# Altium project PSRR.PrjPcb
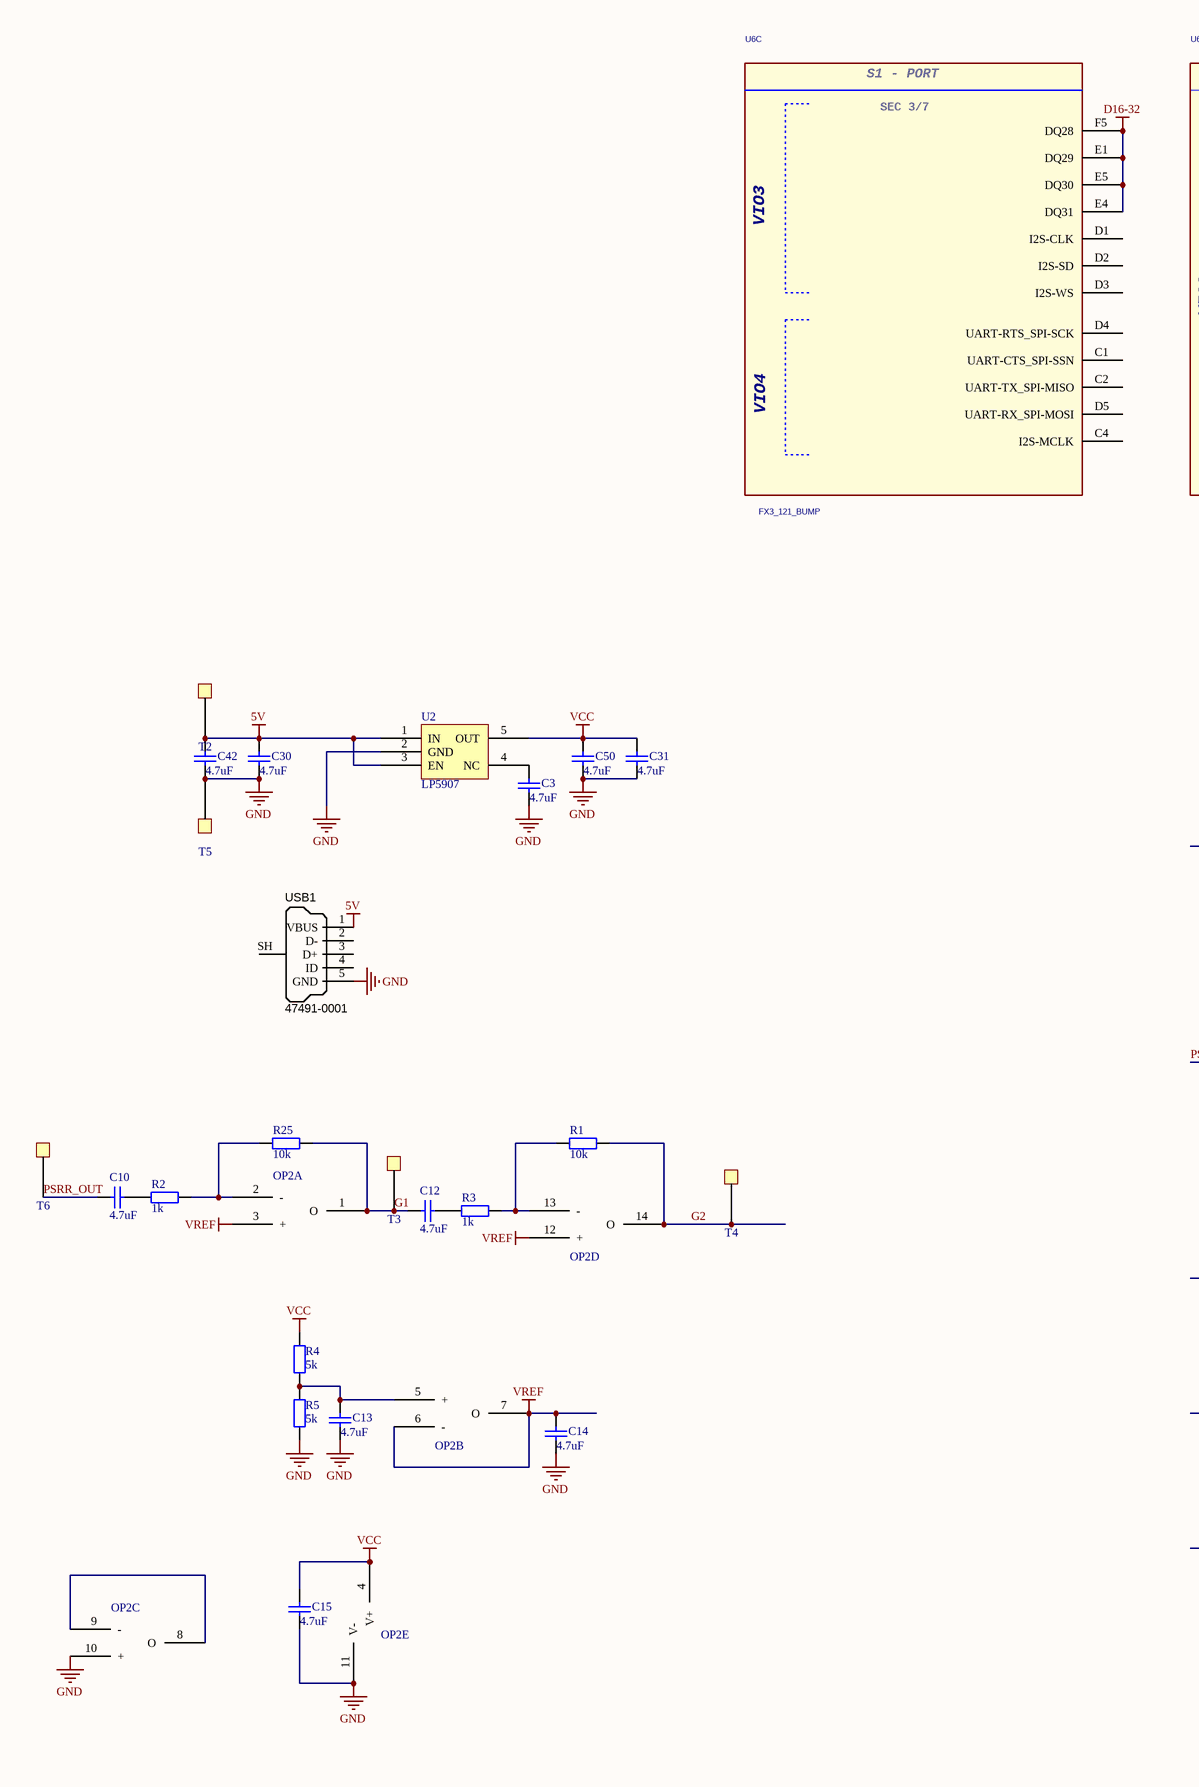
[diagram p0: PSRR.SchDoc, left]
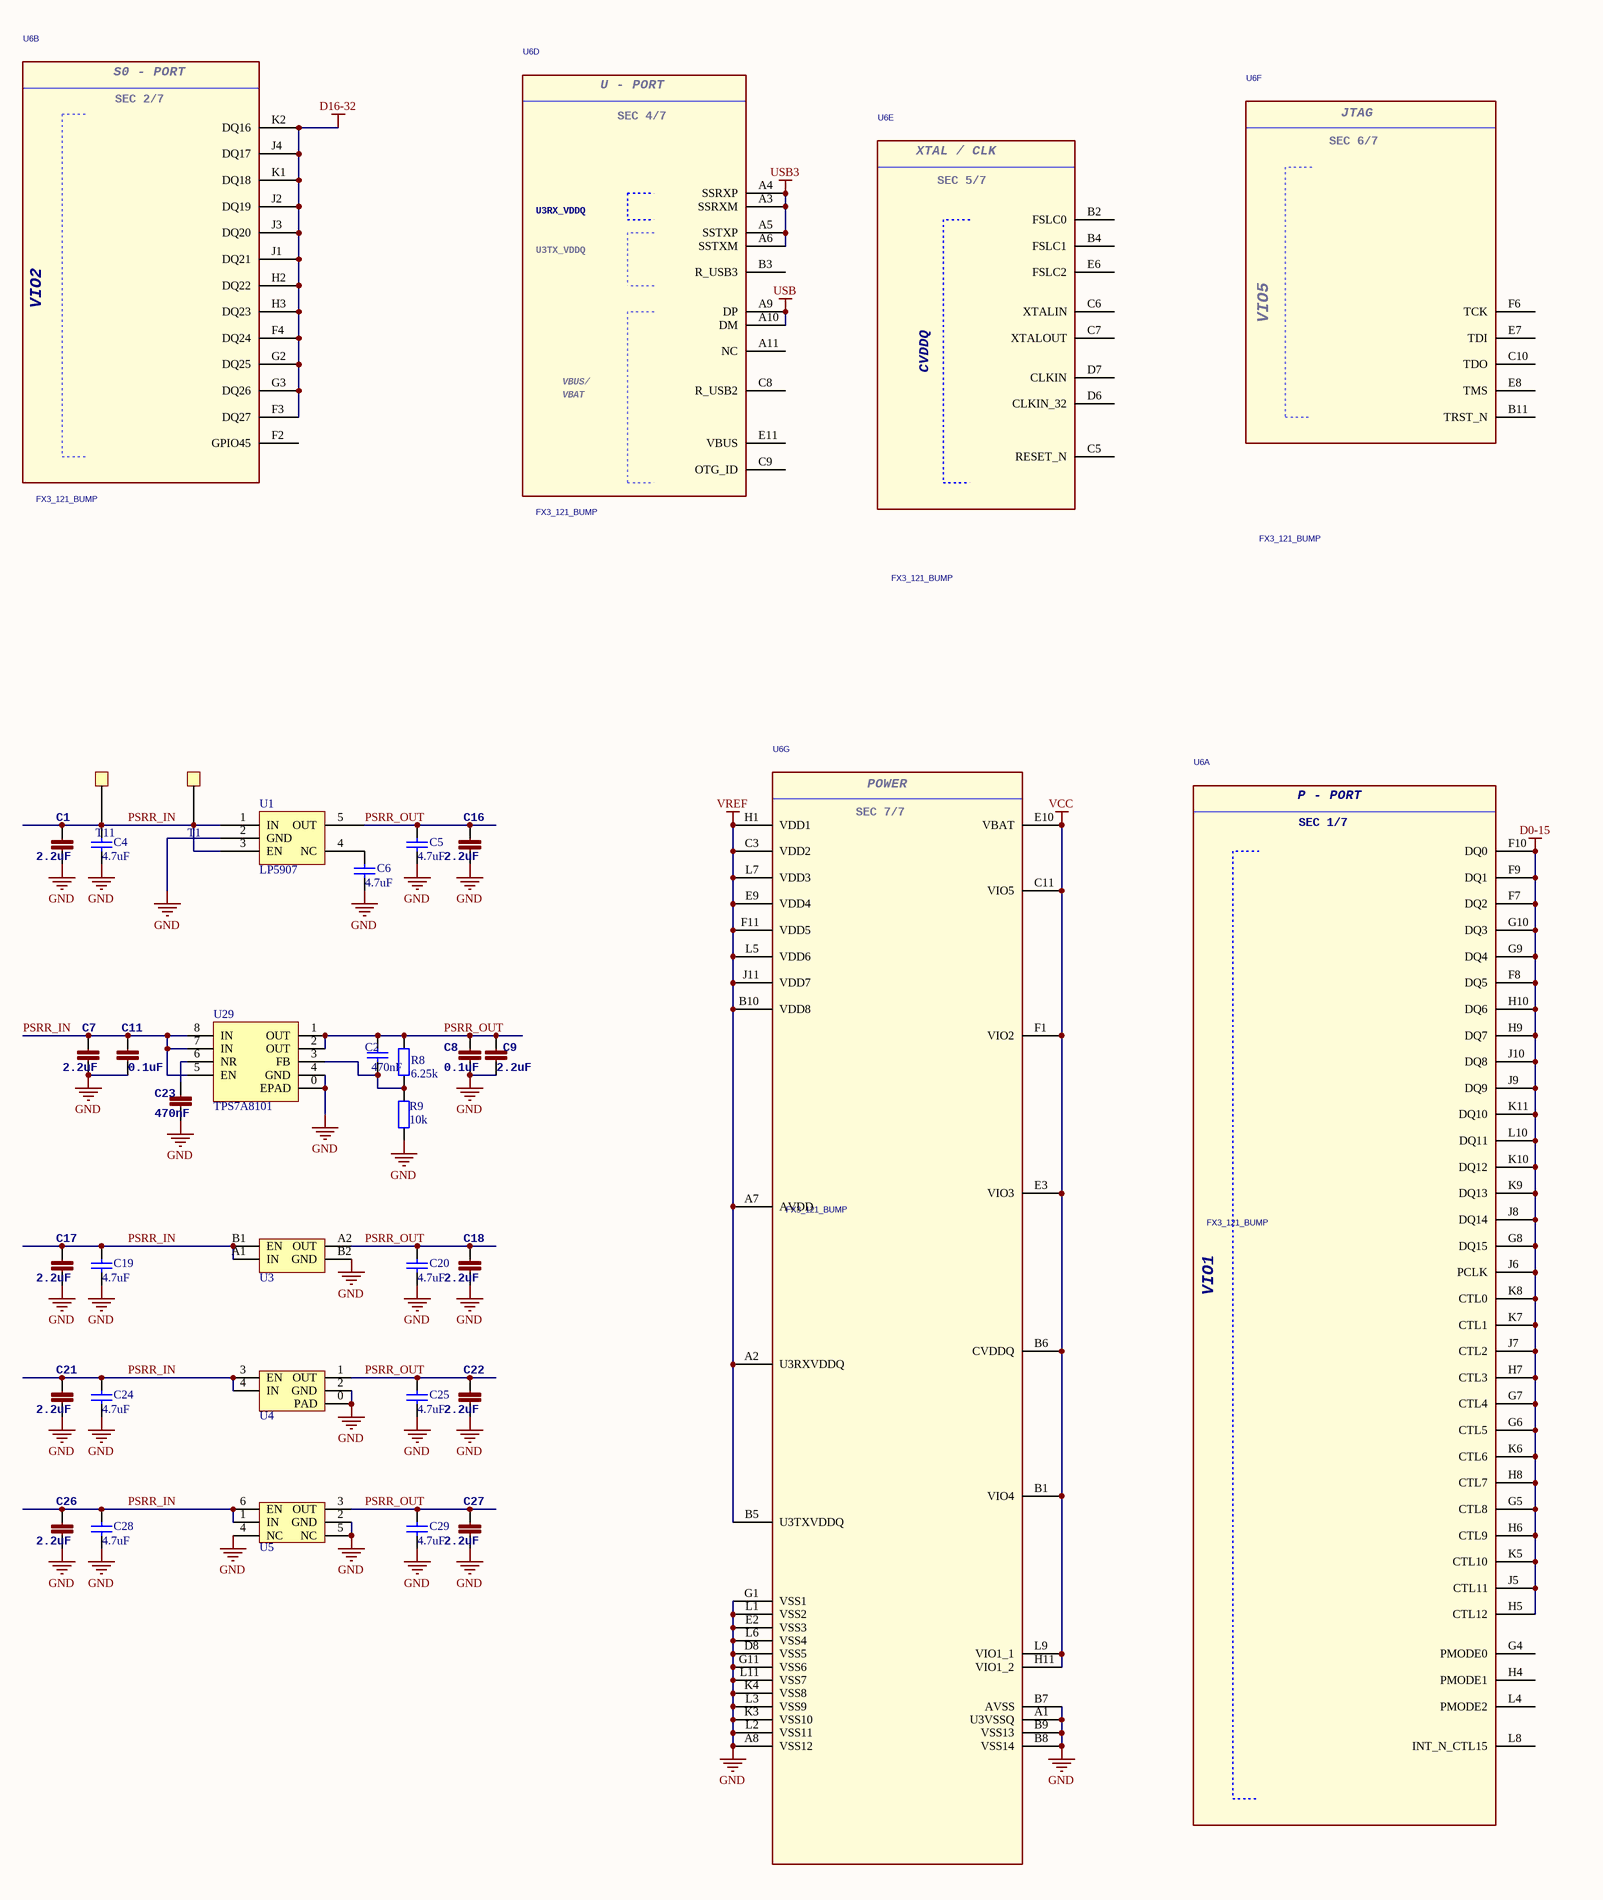
[diagram p1: PSRR.SchDoc, right]
1 sheet, 57 parts. Net scope: global (net labels, ports and power ports of the same name join across sheets).
Board file: PSRR.PcbDoc

## Sheet PSRR.SchDoc
size A2

### Parts
C1  2.2uF  [0603]
C2  470nF  [0402]
C3  4.7uF  [0603]
C4  4.7uF  [0603]
C5  4.7uF  [0603]
C6  4.7uF  [0603]
C7  2.2uF  [0603]
C8  0.1uF  [0603]
C9  2.2uF  [0603]
C10  4.7uF  [0603]
C11  0.1uF  [0402]
C12  4.7uF  [0603]
C13  4.7uF  [0603]
C14  4.7uF  [0603]
C15  4.7uF  [0603]
C16  2.2uF  [0603]
C17  2.2uF  [0603]
C18  2.2uF  [0603]
C19  4.7uF  [0603]
C20  4.7uF  [0603]
C21  2.2uF  [0603]
C22  2.2uF  [0603]
C23  470nF  [0402]
C24  4.7uF  [0603]
C25  4.7uF  [0603]
C26  2.2uF  [0402]
C27  2.2uF  [0402]
C28  4.7uF  [0402]
C29  4.7uF  [0402]
C30  4.7uF  [0603]
C31  4.7uF  [0603]
C42  4.7uF  [0603]
C50  4.7uF  [0603]
OP2  MCP6024  (value not drawn)  (parts A,B,C,D,E of 5)
R1  10k  [0402]
R2  1k  [0402]
R3  1k  [0402]
R4  5k  [0402]
R5  5k  [0402]
R8  6.25k  [0402]
R9  10k  [0402]
R25  10k  [0402]
T1  TestPad  [TestPad]  (value not drawn)
T2  TestPad  [TestPad]  (value not drawn)
T3  TestPad  [TestPad]  (value not drawn)
T4  TestPad  [TestPad]  (value not drawn)
T5  TestPad  [TestPad]  (value not drawn)
T6  TestPad  [TestPad]  (value not drawn)
T11  TestPad  [TestPad]  (value not drawn)
U1  LP5907  [SOT23-5]
U2  LP5907  [SOT23-5]
U3  LP5907-BGA  [DSBGA-4]  (value not drawn)
U4  LP5907-X2SON  [X2SON]  (value not drawn)
U5  TLV700xx-WSON  [WSON]  (value not drawn)
U6  FX3_121_BUMP  [FX3_121_BUMP]  (parts A,B,C,D,E,F,G of 8)
U29  TPS7A8101  [TPS7A8101]
USB1  Manufacturer Part Number 1: 47491-0001  [MICRO-YZX]  (hidden comment: USB Micro Type B)

### Nets
5V: C30.2 C42.2 T2.1 U2.1(IN) U2.3(EN) USB1.1(VBUS)
D0-15: U6.F7(DQ2) U6.F8(DQ5) U6.F9(DQ1) U6.F10(DQ0) U6.G5(CTL8) U6.G6(CTL5) U6.G7(CTL4) U6.G8(DQ15) U6.G9(DQ4) U6.G10(DQ3) U6.H5(CTL12) U6.H6(CTL9) U6.H7(CTL3) U6.H8(CTL7) U6.H9(DQ7) U6.H10(DQ6) U6.J5(CTL11) U6.J6(PCLK) U6.J7(CTL2) U6.J8(DQ14) U6.J9(DQ9) U6.J10(DQ8) U6.K5(CTL10) U6.K6(CTL6) U6.K7(CTL1) U6.K8(CTL0) U6.K9(DQ13) U6.K10(DQ12) U6.K11(DQ10) U6.L10(DQ11)
D16-32: U6.E1(DQ29) U6.E4(DQ31) U6.E5(DQ30) U6.F3(DQ27) U6.F4(DQ24) U6.F5(DQ28) U6.G2(DQ25) U6.G3(DQ26) U6.H2(DQ22) U6.H3(DQ23) U6.J1(DQ21) U6.J2(DQ19) U6.J3(DQ20) U6.J4(DQ17) U6.K1(DQ18) U6.K2(DQ16)
GND: C1.1 C3.1 C4.1 C5.1 C6.1 C7.1 C8.1 C9.1 C11.1 C13.1 C14.1 C15.1 C16.1 C17.1 C18.1 C19.1 C20.1 C21.1 C22.1 C23.1 C24.1 C25.1 C26.1 C27.1 C28.1 C29.1 C30.1 C31.1 C42.1 C50.1 OP2.10(+) OP2.11(V-) R5.2 R9.2 T5.1 U1.2(GND) U2.2(GND) U3.B2(GND) U4.0(PAD) U4.2(GND) U5.2(GND) U5.4(NC) U5.5(NC) U6.A1(U3VSSQ) U6.A8(VSS12) U6.B7(AVSS) U6.B8(VSS14) U6.B9(VSS13) U6.D8(VSS5) U6.E2(VSS3) U6.G1(VSS1) U6.G11(VSS6) U6.K3(VSS10) U6.K4(VSS8) U6.L1(VSS2) U6.L2(VSS11) U6.L3(VSS9) U6.L6(VSS4) U6.L11(VSS7) U29.0(EPAD) U29.4(GND) USB1.5(GND)
USB: U6.A9(DP) U6.A10(DM)
USB3: U6.A3(SSRXM) U6.A4(SSRXP) U6.A5(SSTXP) U6.A6(SSTXM)
VCC: C15.2 C31.2 C50.2 OP2.4(V+) R4.1 U2.5(OUT) U6.B1(VIO4) U6.B6(CVDDQ) U6.C11(VIO5) U6.E3(VIO3) U6.E10(VBAT) U6.F1(VIO2) U6.H11(VIO1_2) U6.L9(VIO1_1)
VREF: C14.2 OP2.3(+) OP2.6(-) OP2.7(O) OP2.12(+) U6.A2(U3RXVDDQ) U6.A7(AVDD) U6.B5(U3TXVDDQ) U6.B10(VDD8) U6.C3(VDD2) U6.E9(VDD4) U6.F11(VDD5) U6.H1(VDD1) U6.J11(VDD7) U6.L5(VDD6) U6.L7(VDD3)
G1: C12.2 OP2.1(O) R25.2 T3.1
G2: OP2.14(O) R1.2 T4.1
PSRR_IN: C1.2 C4.2 C7.2 C11.2 C17.2 C19.2 C21.2 C24.2 C26.2 C28.2 T1.1 T11.1 U1.1(IN) U1.3(EN) U3.A1(IN) U3.B1(EN) U4.3(EN) U4.4(IN) U5.1(IN) U5.6(EN) U29.5(EN) U29.7(IN) U29.8(IN)
PSRR_OUT: C2.1 C5.2 C8.2 C9.2 C10.2 C16.2 C18.2 C20.2 C22.2 C25.2 C27.2 C29.2 R8.1 T6.1 U1.5(OUT) U3.A2(OUT) U4.1(OUT) U5.3(OUT) U29.1(OUT) U29.2(OUT)
NetC2_2: C2.2 R8.2 R9.1 U29.3(FB)
NetC3_2: C3.2 U2.4(NC)
NetC6_2: C6.2 U1.4(NC)
NetC10_1: C10.1 R2.1
NetC12_1: C12.1 R3.1
NetC13_2: C13.2 OP2.5(+) R4.2 R5.1
NetC23_2: C23.2 U29.6(NR)
NetOP2_2: OP2.2(-) R2.2 R25.1
NetOP2_8: OP2.8(O) OP2.9(-)
NetOP2_13: OP2.13(-) R1.1 R3.2

Not connected (* = marked no-connect by the designer): U6 A11(NC) B2(FSLC0) B3(R_USB3) B4(FSLC1) B11(TRST_N) C1(UART-CTS_SPI-SSN) C2(UART-TX_SPI-MISO) C4(I2S-MCLK) C5(RESET_N) C6(XTALIN) C7(XTALOUT) C8(R_USB2) C9(OTG_ID) C10(TDO) D1(I2S-CLK) D2(I2S-SD) D3(I2S-WS) D4(UART-RTS_SPI-SCK) D5(UART-RX_SPI-MOSI) D6(CLKIN_32) D7(CLKIN) E6(FSLC2) E7(TDI) E8(TMS) E11(VBUS) F2(GPIO45) F6(TCK) G4(PMODE0) H4(PMODE1) L4(PMODE2) L8(INT_N_CTL15); USB1 2(D-) 3(D+) 4(ID) SH(Shell)

### Notes on the sheet
- (in symbol FX3_121_BUMP_10, part A) P - PORT; SEC 1/7; VIO1
- (in symbol FX3_121_BUMP_10, part B) S0 - PORT; SEC 2/7
- (in symbol FX3_121_BUMP_10, part C) S1 - PORT; SEC 3/7
- (in symbol FX3_121_BUMP_10, part D) U - PORT; SEC 4/7; U3RX_VDDQ; U3TX_VDDQ; VBUS/
- (in symbol FX3_121_BUMP_10, part E) XTAL / CLK; SEC 5/7
- (in symbol FX3_121_BUMP_10, part F) JTAG; SEC 6/7
- (in symbol FX3_121_BUMP_10, part G) POWER; SEC 7/7

### Library data of the parts
C1 C7-C9 C11 C16-C18 C21-C23 C26 C27 = CAP0402-CAP: <b>Capacitor</b> / Standard 0603 ceramic capacitor, and 0.1" leaded capacitor.; PARTNO: CC0402ZRY5V7BB104
C2-C6 C10 C12-C15 C19 C20 C24 C25 C28-C31 C42 C50 = Cap: Capacitor; Published: 8-Jun-2000; LatestRevisionDate: 17-Jul-2002; LatestRevisionNote: Re-released for DXP Platform.; PackageReference: RAD-0.3; Publisher: Altium Limited; PackageDescription: Radial Cap, Thru-Hole; 2 Leads; 0.3 in Pin Spacing
OP2 = OP-SOP14
R1-R5 R25 = Res2: Resistor; Published: 8-Jun-2000; LatestRevisionDate: 17-Jul-2002; LatestRevisionNote: Re-released for DXP Platform.; PackageReference: AXIAL-0.4; Publisher: Altium Limited; PackageDescription: Axial Device, Thru-Hole; 2 Leads; 0.4 in Pin Spacing
R8 R9 = Res2: Resistor; Value: 0Ohm; Published: 8-Jun-2000; LatestRevisionDate: 17-Jul-2002; LatestRevisionNote: Re-released for DXP Platform.; PackageReference: AXIAL-0.4; Publisher: Altium Limited; PackageDescription: Axial Device, Thru-Hole; 2 Leads; 0.4 in Pin Spacing
U6 = FX3_121_BUMP_10: FX3; Manufacturer: Cypress
USB1 = USB_Micro_TypeB: Connector SMD USB Micro Type B middle mount; Manufacturer 1: Molex Inc; SCDType: undef; Package / Case: SMD; Supplier 1: Digi-Key; Supplier Part Number 1: WM17142CT-ND